# EAGLE design ThrusterBoardV1.1 (EAGLE 6.6.0)
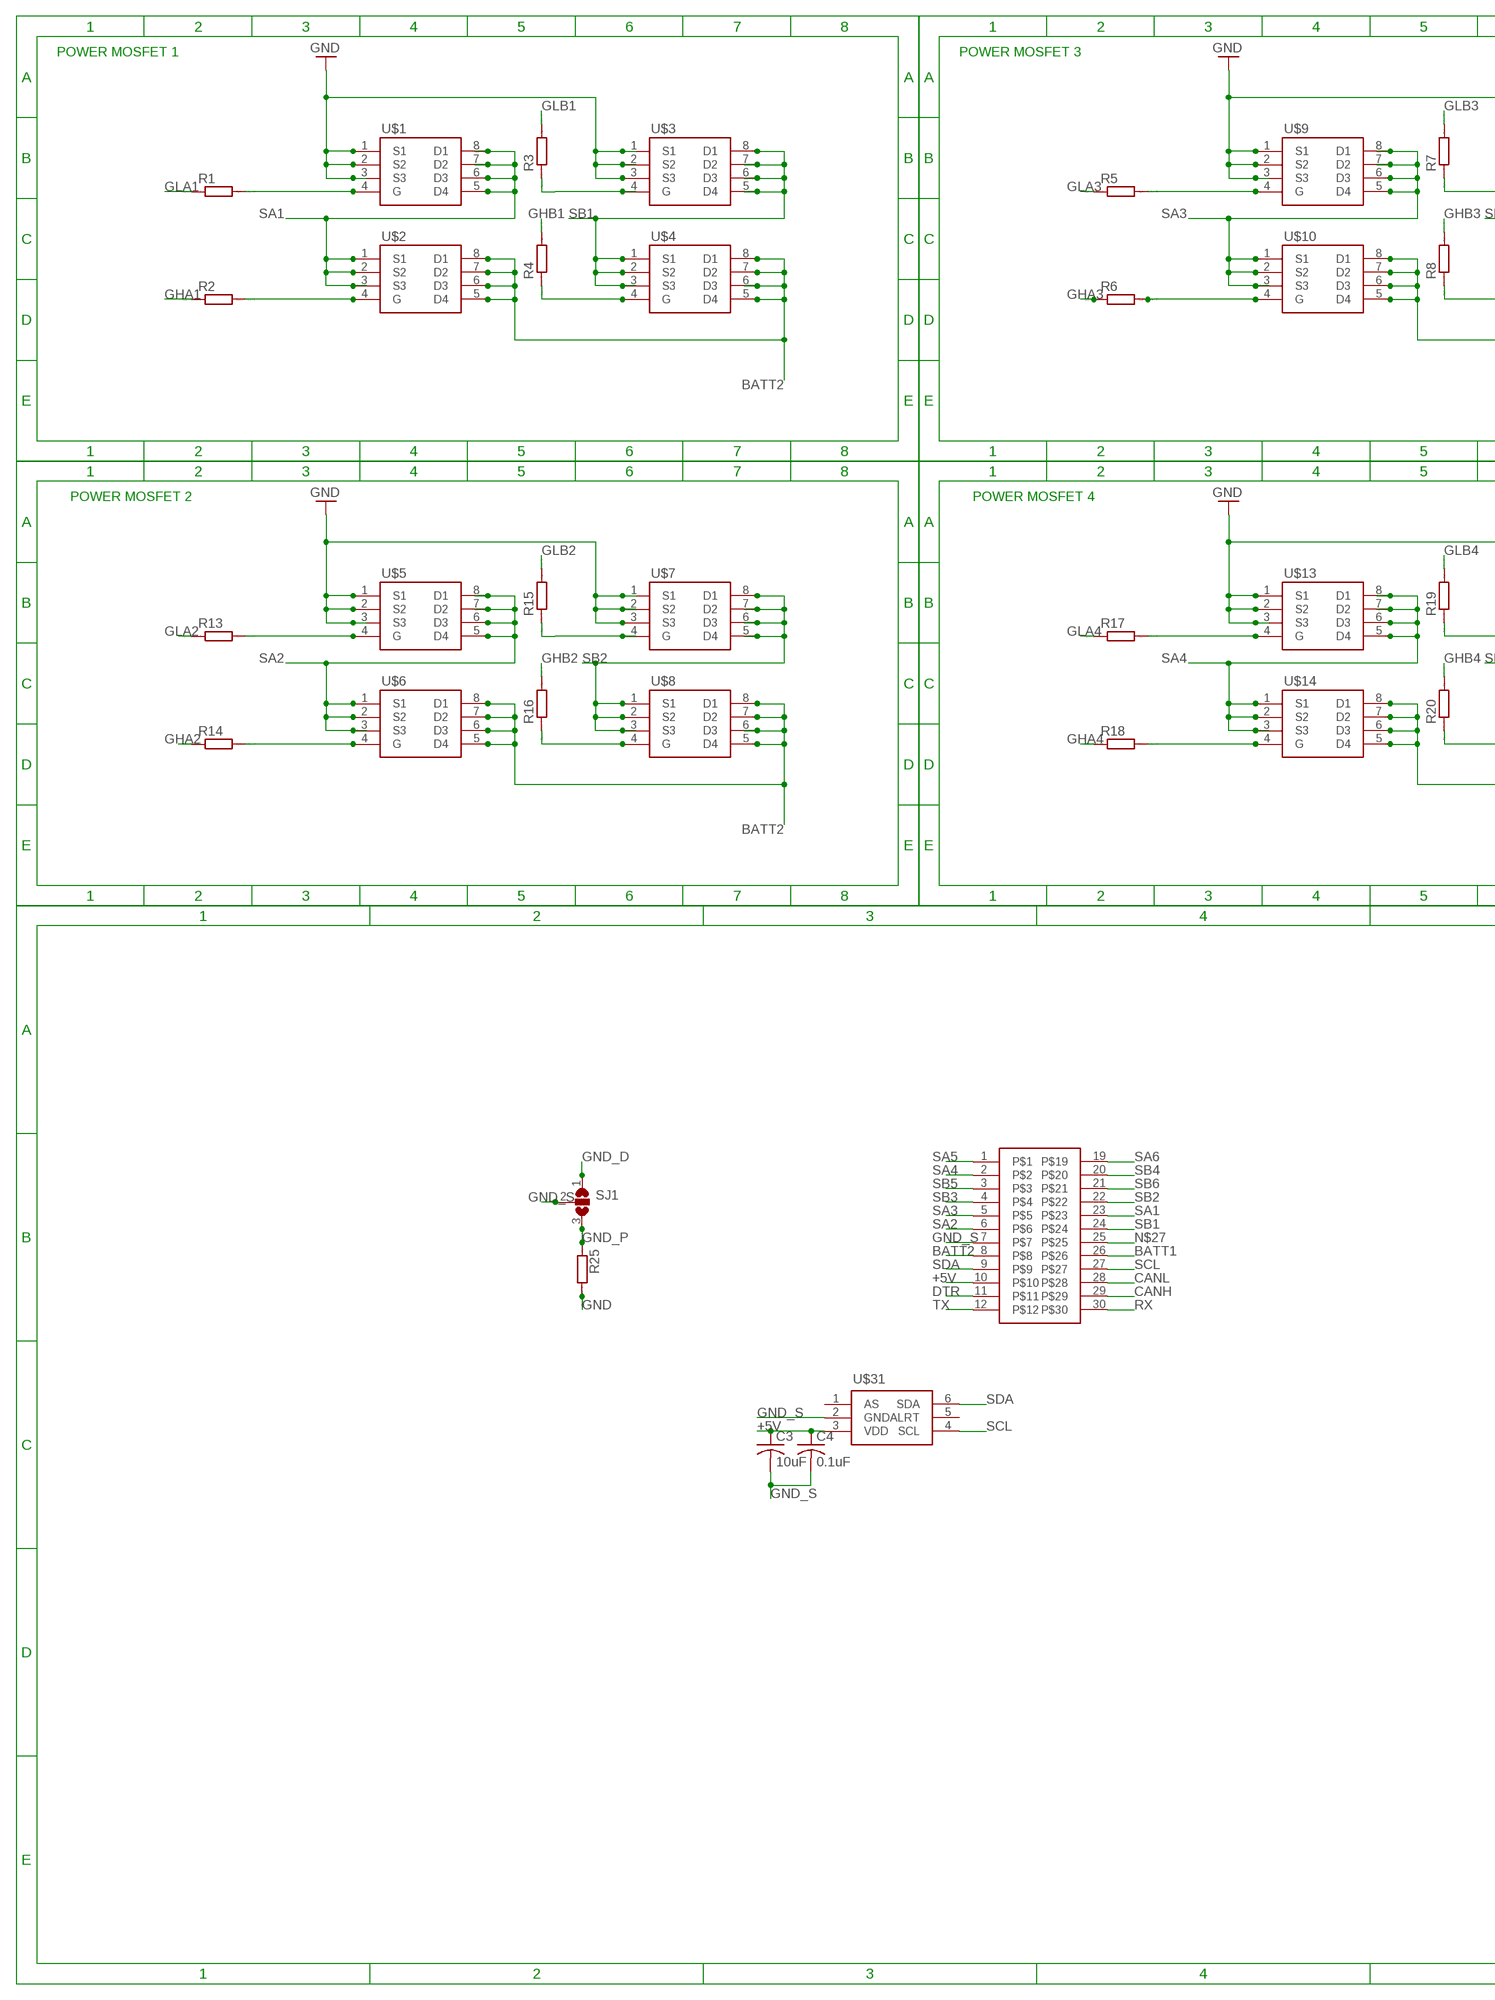
[diagram p0: schematic, sheet 1, part 1 of 2]
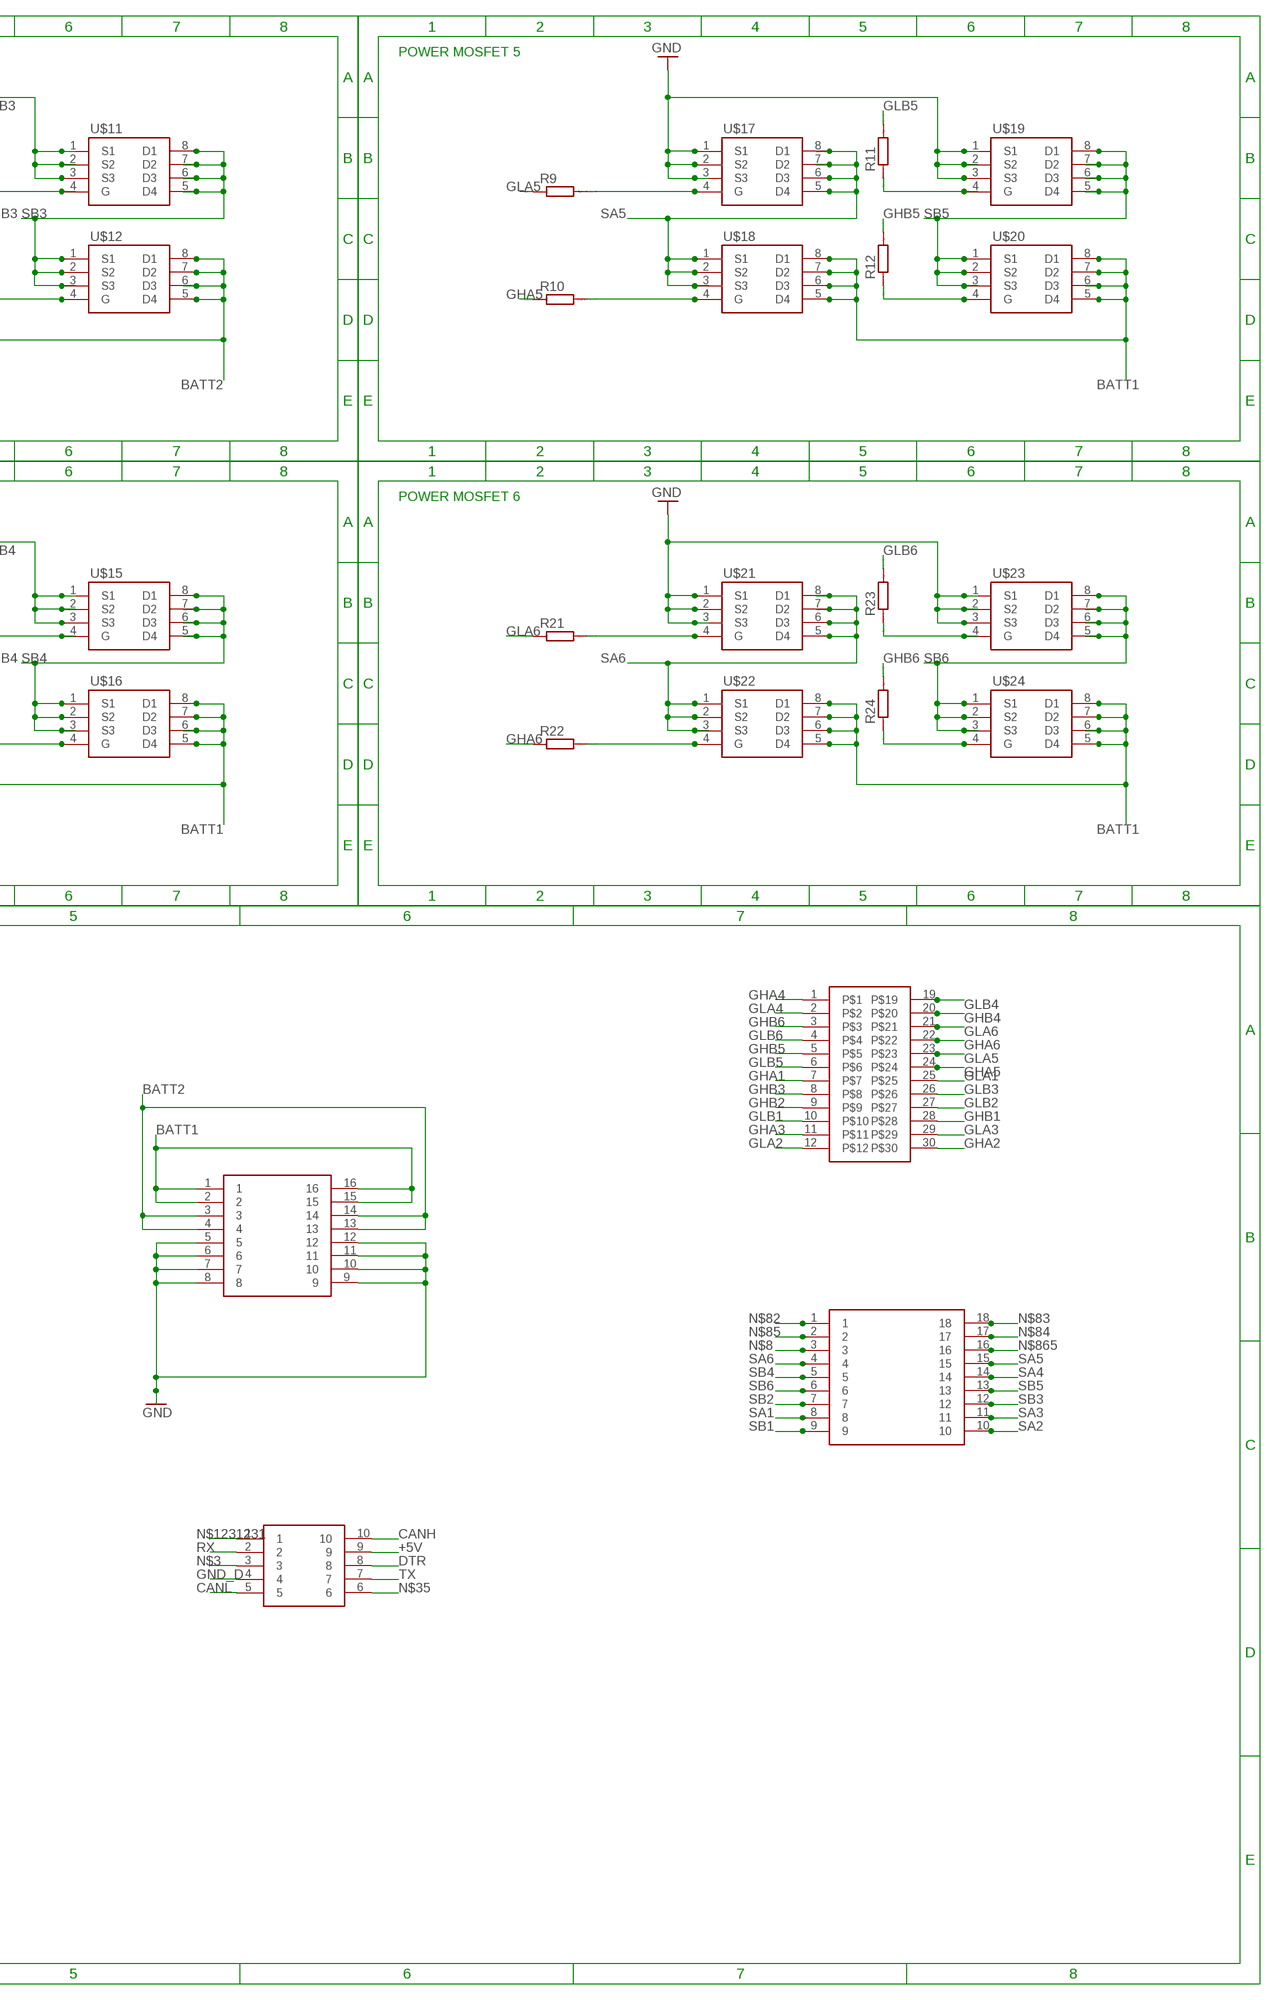
[diagram p1: schematic, sheet 1, part 2 of 2]

## Parts
C3  10uF  C-USC0805  [C0805]
C4  0.1uF  C-USC0805  [C0805]
R1  R  [R0805]
R2  R  [R0805]
R3  R  [R0805]
R4  R  [R0805]
R5  R  [R0805]
R6  R  [R0805]
R7  R  [R0805]
R8  R  [R0805]
R9  R  [R0805]
R10  R  [R0805]
R11  R  [R0805]
R12  R  [R0805]
R13  R  [R0805]
R14  R  [R0805]
R15  R  [R0805]
R16  R  [R0805]
R17  R  [R0805]
R18  R  [R0805]
R19  R  [R0805]
R20  R  [R0805]
R21  R  [R0805]
R22  R  [R0805]
R23  R  [R0805]
R24  R  [R0805]
R25  R  [R0805]
SJ1  SJ2W  [SJ_2]
U$1  IRF7842PBF  [SO-8]
U$2  IRF7842PBF  [SO-8]
U$3  IRF7842PBF  [SO-8]
U$4  IRF7842PBF  [SO-8]
U$5  IRF7842PBF  [SO-8]
U$6  IRF7842PBF  [SO-8]
U$7  IRF7842PBF  [SO-8]
U$8  IRF7842PBF  [SO-8]
U$9  IRF7842PBF  [SO-8]
U$10  IRF7842PBF  [SO-8]
U$11  IRF7842PBF  [SO-8]
U$12  IRF7842PBF  [SO-8]
U$13  IRF7842PBF  [SO-8]
U$14  IRF7842PBF  [SO-8]
U$15  IRF7842PBF  [SO-8]
U$16  IRF7842PBF  [SO-8]
U$17  IRF7842PBF  [SO-8]
U$18  IRF7842PBF  [SO-8]
U$19  IRF7842PBF  [SO-8]
U$20  IRF7842PBF  [SO-8]
U$21  IRF7842PBF  [SO-8]
U$22  IRF7842PBF  [SO-8]
U$23  IRF7842PBF  [SO-8]
U$24  IRF7842PBF  [SO-8]
U$25  15-24-6163  [15-24-6163]
U$26  50-36-1836  [50-36-1836]
U$27  15-24-6103  [15-24-6103]
U$28  15-45-3136  [15-45-3136]
U$29  15-45-3136  [15-45-3136]
U$31  AD7414  [SOT23-6]

## Nets
+5V: C3.1 C4.1 U$27.9 U$29.10 U$31.3(VDD)
ASDASD: R2.2 U$2.4(G)
BATT1: U$14.5(D4) U$14.6(D3) U$14.7(D2) U$14.8(D1) U$16.5(D4) U$16.6(D3) U$16.7(D2) U$16.8(D1) U$18.5(D4) U$18.6(D3) U$18.7(D2) U$18.8(D1) U$20.5(D4) U$20.6(D3) U$20.7(D2) U$20.8(D1) U$22.5(D4) U$22.6(D3) U$22.7(D2) U$22.8(D1) U$24.5(D4) U$24.6(D3) U$24.7(D2) U$24.8(D1) U$25.1 U$25.2 U$25.15 U$25.16 U$29.26
BATT2: U$2.5(D4) U$2.6(D3) U$2.7(D2) U$2.8(D1) U$4.5(D4) U$4.6(D3) U$4.7(D2) U$4.8(D1) U$6.5(D4) U$6.6(D3) U$6.7(D2) U$6.8(D1) U$8.5(D4) U$8.6(D3) U$8.7(D2) U$8.8(D1) U$10.5(D4) U$10.6(D3) U$10.7(D2) U$10.8(D1) U$12.5(D4) U$12.6(D3) U$12.7(D2) U$12.8(D1) U$25.3 U$25.4 U$25.13 U$25.14 U$29.8
CANH: U$27.10 U$29.29
CANL: U$27.5 U$29.28
DTR: U$27.8 U$29.11
GHA1: R2.1 U$28.7
GHA2: R14.1 U$28.30
GHA3: R6.1 U$28.11
GHA4: R18.1 U$28.1
GHA5: R10.1 U$28.24
GHA6: R22.1 U$28.22
GHB1: R4.2 U$28.28
GHB2: R16.2 U$28.9
GHB3: R8.2 U$28.8
GHB4: R20.2 U$28.20
GHB5: R12.2 U$28.5
GHB6: R24.2 U$28.3
GLA1: R1.1 U$28.25
GLA2: R13.1 U$28.12
GLA3: R5.1 U$28.29
GLA4: R17.1 U$28.2
GLA5: R9.1 U$28.23
GLA6: R21.1 U$28.21
GLB1: R3.2 U$28.10
GLB2: R15.2 U$28.27
GLB3: R7.2 U$28.26
GLB4: R19.2 U$28.19
GLB5: R11.2 U$28.6
GLB6: R23.2 U$28.4
GND: R25.2 U$1.1(S1) U$1.2(S2) U$1.3(S3) U$3.1(S1) U$3.2(S2) U$3.3(S3) U$5.1(S1) U$5.2(S2) U$5.3(S3) U$7.1(S1) U$7.2(S2) U$7.3(S3) U$9.1(S1) U$9.2(S2) U$9.3(S3) U$11.1(S1) U$11.2(S2) U$11.3(S3) U$13.1(S1) U$13.2(S2) U$13.3(S3) U$15.1(S1) U$15.2(S2) U$15.3(S3) U$17.1(S1) U$17.2(S2) U$17.3(S3) U$19.1(S1) U$19.2(S2) U$19.3(S3) U$21.1(S1) U$21.2(S2) U$21.3(S3) U$23.1(S1) U$23.2(S2) U$23.3(S3) U$25.5 U$25.6 U$25.7 U$25.8 U$25.9 U$25.10 U$25.11 U$25.12
GND_D: SJ1.1 U$27.4
GND_P: R25.1 SJ1.3
GND_S: C3.2 C4.2 SJ1.2 U$29.7 U$31.2(GND)
N$3: U$27.3
N$5: R3.1 U$3.4(G)
N$8: U$26.3
N$18: R4.1 U$4.4(G)
N$19: R5.2 U$9.4(G)
N$20: R6.2 U$10.4(G)
N$27: U$29.25
N$30: R7.1 U$11.4(G)
N$31: R8.1 U$12.4(G)
N$32: R9.2 U$17.4(G)
N$33: R10.2 U$18.4(G)
N$34: R11.1 U$19.4(G)
N$35: U$27.6
N$36: R12.1 U$20.4(G)
N$37: R13.2 U$5.4(G)
N$38: R14.2 U$6.4(G)
N$39: R16.1 U$8.4(G)
N$40: R15.1 U$7.4(G)
N$41: R17.2 U$13.4(G)
N$42: R18.2 U$14.4(G)
N$43: R20.1 U$16.4(G)
N$44: R19.1 U$15.4(G)
N$45: R21.2 U$21.4(G)
N$46: R22.2 U$22.4(G)
N$47: R23.1 U$23.4(G)
N$48: R24.1 U$24.4(G)
N$82: U$26.1
N$83: U$26.18
N$84: U$26.17
N$85: U$26.2
N$865: U$26.16
N$23131: R1.2 U$1.4(G)
N$1231231: U$27.1
RX: U$27.2 U$29.30
SA1: U$1.5(D4) U$1.6(D3) U$1.7(D2) U$1.8(D1) U$2.1(S1) U$2.2(S2) U$2.3(S3) U$26.8 U$29.23
SA2: U$5.5(D4) U$5.6(D3) U$5.7(D2) U$5.8(D1) U$6.1(S1) U$6.2(S2) U$6.3(S3) U$26.10 U$29.6
SA3: U$9.5(D4) U$9.6(D3) U$9.7(D2) U$9.8(D1) U$10.1(S1) U$10.2(S2) U$10.3(S3) U$26.11 U$29.5
SA4: U$13.5(D4) U$13.6(D3) U$13.7(D2) U$13.8(D1) U$14.1(S1) U$14.2(S2) U$14.3(S3) U$26.14 U$29.2
SA5: U$17.5(D4) U$17.6(D3) U$17.7(D2) U$17.8(D1) U$18.1(S1) U$18.2(S2) U$18.3(S3) U$26.15 U$29.1
SA6: U$21.5(D4) U$21.6(D3) U$21.7(D2) U$21.8(D1) U$22.1(S1) U$22.2(S2) U$22.3(S3) U$26.4 U$29.19
SB1: U$3.5(D4) U$3.6(D3) U$3.7(D2) U$3.8(D1) U$4.1(S1) U$4.2(S2) U$4.3(S3) U$26.9 U$29.24
SB2: U$7.5(D4) U$7.6(D3) U$7.7(D2) U$7.8(D1) U$8.1(S1) U$8.2(S2) U$8.3(S3) U$26.7 U$29.22
SB3: U$11.5(D4) U$11.6(D3) U$11.7(D2) U$11.8(D1) U$12.1(S1) U$12.2(S2) U$12.3(S3) U$26.12 U$29.4
SB4: U$15.5(D4) U$15.6(D3) U$15.7(D2) U$15.8(D1) U$16.1(S1) U$16.2(S2) U$16.3(S3) U$26.5 U$29.20
SB5: U$19.5(D4) U$19.6(D3) U$19.7(D2) U$19.8(D1) U$20.1(S1) U$20.2(S2) U$20.3(S3) U$26.13 U$29.3
SB6: U$23.5(D4) U$23.6(D3) U$23.7(D2) U$23.8(D1) U$24.1(S1) U$24.2(S2) U$24.3(S3) U$26.6 U$29.21
SCL: U$29.27 U$31.4(SCL)
SDA: U$29.9 U$31.6(SDA)
TX: U$27.7 U$29.12
Unconnected: U$31.1(AS) U$31.5(ALRT)

## Notes on the sheet
- POWER MOSFET 1 | POWER MOSFET 3 | POWER MOSFET 5
- POWER MOSFET 2 | POWER MOSFET 4 | POWER MOSFET 6

## Library data of the parts
C3 C4 = rcl:C-US: CAPACITOR, American symbol
R1-R25 = eagle-ltspice:R: RESISTOR, European symbol; SPICEMODEL: NONE; SPICEPREFIX: R
SJ1 = jumper:SJ2W: SMD solder JUMPER
U$1-U$24 = bbauv:IRF7842PBF
U$25 = bbauv:15-24-6163: Mini-Fit® BMI Header, Dual Row, Right Angle, with Snap-in Plastic Peg PCB Lock, 16 Circuits, PA Polyamide Nylon 6/6 94V-0, with Select Gold (Au) Plating
U$26 = bbauv:50-36-1836: Mini-Fit® Jr. Header, Dual Row, Right Angle, with Snap-in Plastic Peg PCB Lock, 18 Circuits, PA Polyamide Nylon 6/6 94V-0,0.76µm Gold (Au) Plating
U$27 = bbauv:15-24-6103
U$28 U$29 = bbauv:15-45-3136: 2.54mm Pitch C-Grid® PCB Connector, Surface Mount, High Profile, Dual Row, Vertical, 36 Circuits
U$31 = bbauv:AD7414: ±0.5°C Accurate, 10-Bit Digital Temperature Sensors in SOT-23 The AD7414/AD7415 are complete temperature monitoring systems in 6-lead and 5-lead SOT-23 packages. They contain a band gap temperature sensor and a 10-bit ADC to monitor and digitize the temperature reading to a resolution of 0.25°C.

## Board
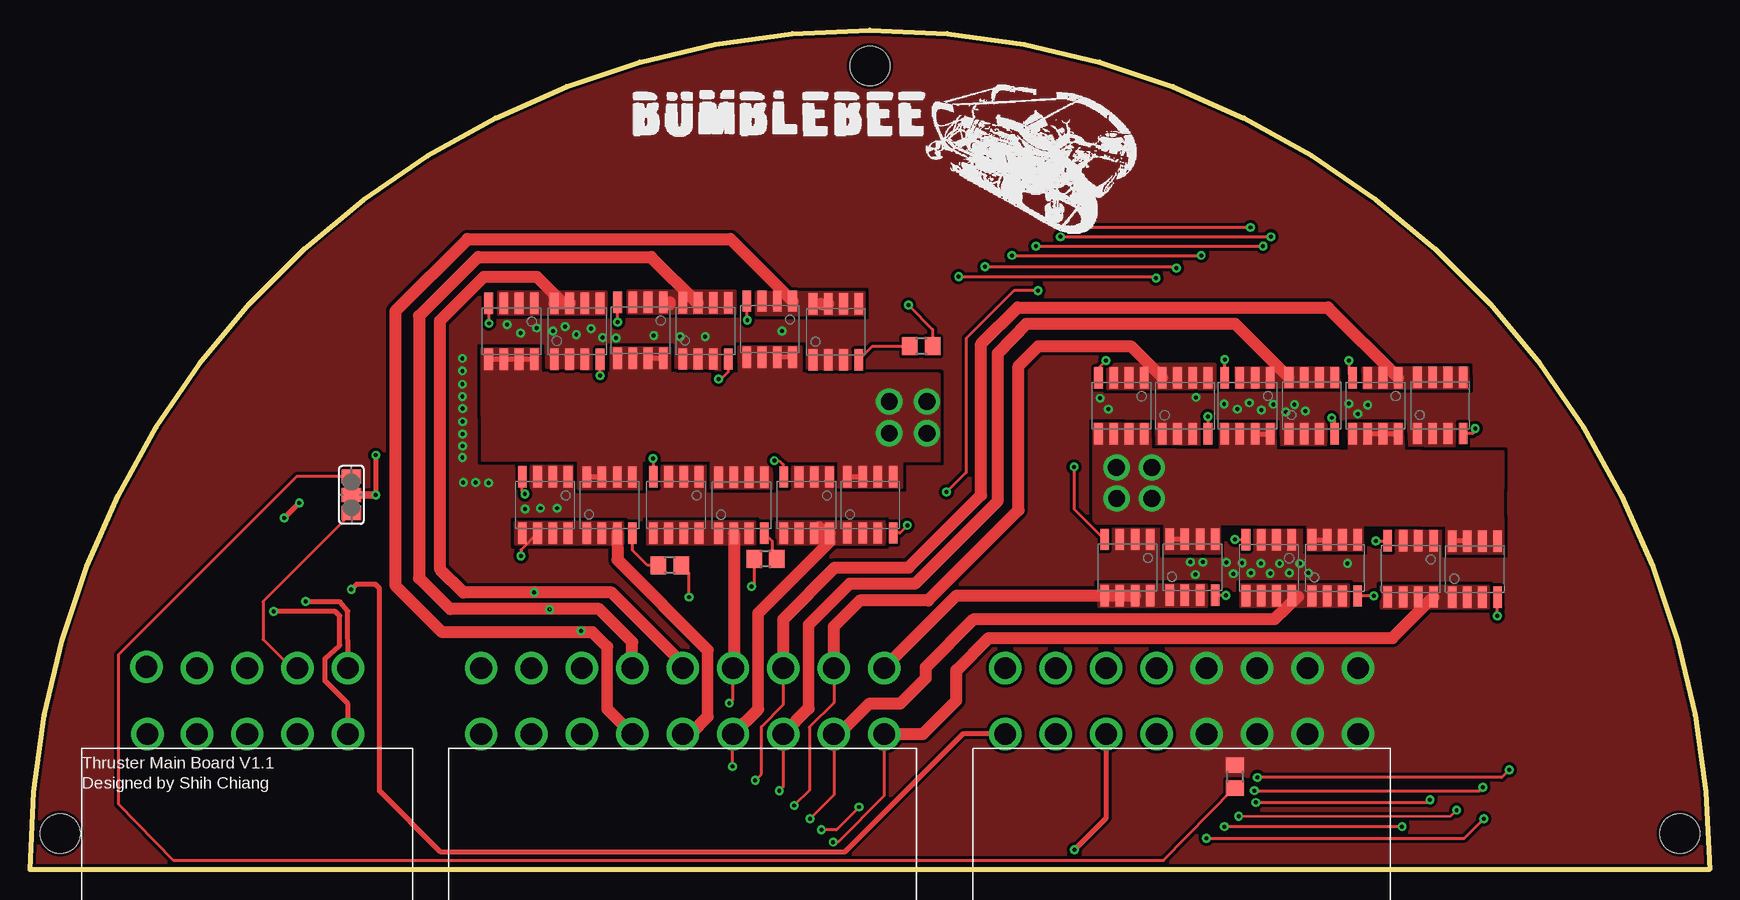
[diagram p2: board, top side]
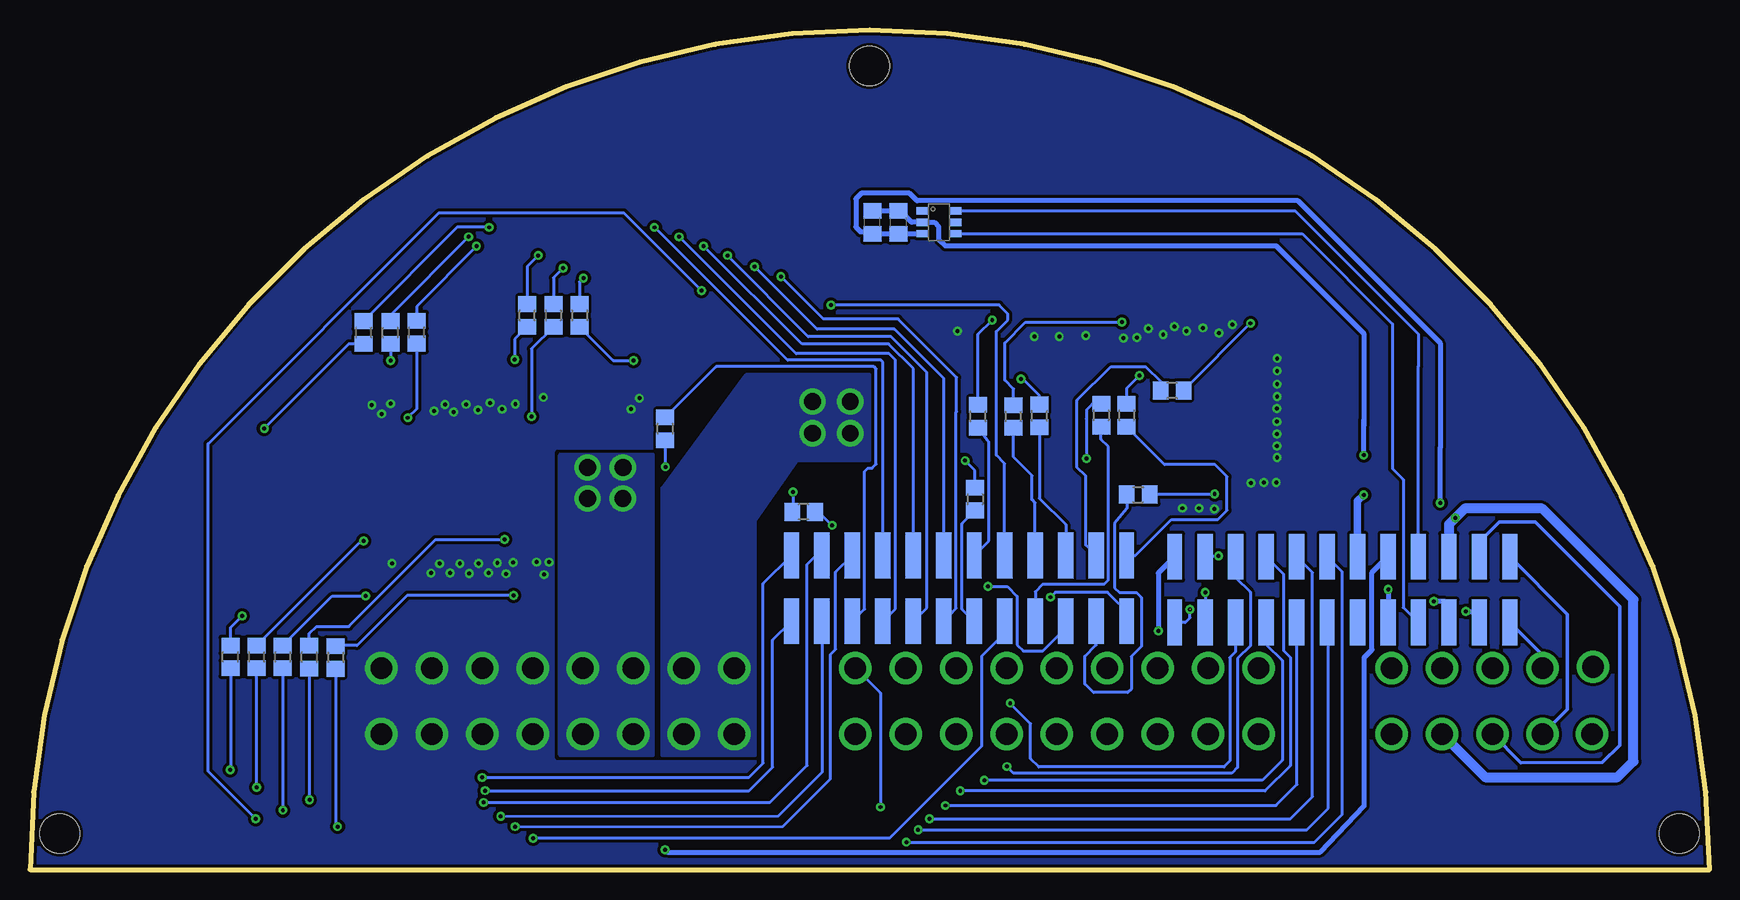
[diagram p3: board, bottom side, seen from below]

Size 140 x 70 mm. Coordinates in mm from the lower left corner, seen from the top.
Outline: 140,0 0,0 arc-90 70,70 arc-90 140,0
Copper layers (1*16): Top 0.035mm / dielectric 1.5mm / Bottom 0.035mm
Design rules "3ozKentronics": minimum track width 10mil, minimum drill 12mil, track to track 10mil, track to pad 10mil, pad to pad 10mil, via to via 10mil, smd to smd 0mil, copper to edge 10mil, drill to drill 10mil, minimum pad ring 12mil, minimum via ring 8mil, stop-mask expansion 2mil, vias tented up to drill 25mil, thermal gap 10mil
Holes 3.3 mm at 2.52,3 137.52,3 70.02,67

### Footprints (pad centres in the part's own frame; a part is rotated, then mirrored left to right if it is on the bottom)
C0805 = smd 1.3 x 1.5: 1 -0.95,0; 2 0.95,0
R0805 = smd 1.3 x 1.5: 1 -0.95,0; 2 0.95,0
SJ_2 = smd 1.168 x 1.6: 1 -1.524,0; 2 0,0; 3 1.524,0
SO-8 = smd 0.72 x 1.78: 1 -1.905,-2.34; 2 -0.635,-2.34; 3 0.635,-2.34; 4 1.905,-2.34; 5 1.905,2.34; 6 0.635,2.34; 7 -0.635,2.34; 8 -1.905,2.34
15-24-6163 = drill 1.8: 1 -14.7,0; 2 -10.5,0; 3 -6.3,0; 4 -2.1,0; 5 2.1,0; 6 6.3,0; 7 10.5,0; 8 14.7,0; 9 14.7,-5.5; 10 10.5,-5.5; 11 6.3,-5.5; 12 2.1,-5.5; 13 -2.1,-5.5; 14 -6.3,-5.5; 15 -10.5,-5.5; 16 -14.7,-5.5
50-36-1836 = drill 1.8 pad 2.184: 1 -16.8,0; 2 -12.6,0; 3 -8.4,0; 4 -4.2,0; 5 0,0; 6 4.2,0; 7 8.4,0; 8 12.6,0; 9 16.8,0; 10 16.8,-5.5; 11 12.6,-5.5; 12 8.4,-5.5; 13 4.2,-5.5; 14 0,-5.5; 15 -4.2,-5.5; 16 -8.4,-5.5; 17 -12.6,-5.5; 18 -16.8,-5.5
15-24-6103 = drill 1.8: 1 -8.4,0.1; 2 -4.2,0; 3 0,0; 4 4.2,0; 5 8.4,0; 6 -8.3,-5.5; 7 -4.2,-5.5; 8 0,-5.5; 9 4.2,-5.5; 10 8.4,-5.5
15-45-3136 = smd 1.219 x 3.81: 1 -22.86,2.745; 19 -22.86,-2.745; 24 -10.16,-2.745 | smd 1.27 x 3.81: 2 -20.32,2.745; 3 -17.78,2.745; 4 -15.24,2.745; 5 -12.7,2.745; 6 -10.16,2.745; 7 -7.62,2.745; 8 -5.08,2.745; 9 -2.54,2.745; 10 0,2.745; 11 2.54,2.745; 12 5.08,2.745; 20 -20.32,-2.745; 21 -17.78,-2.745; 22 -15.24,-2.745; 23 -12.7,-2.745; 25 -7.62,-2.745; 26 -5.08,-2.745; 27 -2.54,-2.745; 28 0,-2.745; 29 2.54,-2.745; 30 5.08,-2.745
SOT23-6 = smd 0.6 x 1.05: 1 -0.95,-1.35; 2 0,-1.35; 3 0.95,-1.35; 4 0.95,1.35; 5 0,1.35; 6 -0.95,1.35

### Placement (x,y rotation side)
C3  67.61,53.96 90 bottom
C4  69.79,53.96 90 bottom
R1  96.37,46.2 270 bottom
R2  94.19,46.2 270 bottom
R3  87.05,36.75 90 bottom
R4  114.53,17.68 270 bottom
R5  116.71,17.71 90 bottom
R6  118.92,17.73 90 bottom
R7  107.77,44.81 90 bottom
R8  98.55,46.2 90 bottom
R9  74.29,43.63 180 top
R10  60.98,37.8 90 bottom
R11  61.22,30.89 270 bottom
R12  75.51,29.82 180 bottom
R13  121.11,17.73 90 bottom
R14  123.29,17.73 90 bottom
R15  112.19,44.78 90 bottom
R16  109.96,44.78 90 bottom
R17  47.62,31.25 0 bottom
R18  53.34,25.37 180 top
R19  48.59,37.87 270 bottom
R20  44.8,39.94 180 bottom
R21  55.86,37.82 90 bottom
R22  58.02,37.77 90 bottom
R23  50.7,37.87 270 bottom
R24  61.31,25.9 180 top
R25  100.46,7.75 90 top
SJ1  26.8,31.24 90 top
U$1  96.28,38.67 0 top
U$2  90.97,38.66 180 top
U$3  91.48,25.18 180 top
U$4  96.9,25.21 0 top
U$5  115.08,25.07 180 top
U$6  120.43,25.05 0 top
U$7  117.55,38.69 0 top
U$8  112.14,38.67 180 top
U$9  103.26,25.16 180 top
U$10  108.76,25.15 0 top
U$11  106.84,38.69 0 top
U$12  101.48,38.67 180 top
U$13  42.94,30.4 180 top
U$14  48.31,30.39 0 top
U$15  45.62,44.88 0 top
U$16  40.13,44.88 180 top
U$17  67.17,44.83 0 top
U$18  61.66,45.05 180 top
U$19  64.74,30.39 180 top
U$20  70.04,30.4 0 top
U$21  56.32,44.9 0 top
U$22  50.89,44.96 180 top
U$23  53.86,30.4 180 top
U$24  59.3,30.38 0 top
U$25  96,16.8 0 top
U$26  54.4,16.8 0 top
U$27  18.1,16.8 0 top
U$28  71.45,23.44 180 bottom
U$29  21.72,23.34 0 bottom
U$31  64.23,53.96 270 bottom

### Tracks (layer width: path | path; a pad name or v marks a point on that pad's centre or on a via)
+5V  (via drill 0.33)
  Top 0.406: v22.45,30.56 v21.2,29.3
  Bottom 0.406: U$31.3 C3.1 C4.1 69.96,53.19 70.78,53.19 71.16,53.57 71.16,55.93 70.71,56.39 66.69,56.39 66.06,55.75 34.31,55.75 22.45,43.89 22.45,35.17 22.45,35.16 v22.45,30.56
  Bottom 0.813: U$27.9 18.7,7.7 7.67,7.7 6.35,9.02 6.35,22.5 13.94,30.1 20.4,30.1 v21.2,29.3 21.72,28.78 U$29.10 | 21.84,25.37 21.72,25.5 U$29.10 | U$29.10
ASDASD  (via drill 0.33)
  Top 0.254: v89.68,42.44 89.07,41.83 U$2.4
  Top 0.305: 89.06,40.99 U$2.4
  Bottom 0.254: R2.2 91.39,42.44 v89.68,42.44
BATT1  (via drill 0.33, 1.4 pad 2.18)
  Top 0.406: U$22.8 U$22.7 | U$20.7 U$20.8 | U$18.8 U$18.7 | U$16.8 U$16.5 | U$14.7 U$14.8 | U$25.16 77.77,11.3 67.91,1.45 34.23,1.45 29.13,6.55 29.13,23.44 28.8,23.77 27.22,23.77 v26.79,23.34
  Bottom 0.406: v26.79,23.34 U$29.26
  other vias: 71.63,39.01 74.78,39.01 71.63,36.37 74.78,36.37
  pour Top: 37.77,34.21 75.74,34.14 75.74,41.22 37.74,41.3
  pour Top (no thermals): 37.7,43.43 42.47,43.41 42.55,41.02 37.67,41.02
  pour Top (no thermals): 48.44,43.51 53.32,43.48 53.32,40.64 48.44,40.64
  pour Top (no thermals): 59.11,43.56 64.27,43.56 64.29,40.77 59.13,40.77
  pour Top (no thermals): 56.8,34.62 61.78,34.57 61.8,31.78 56.82,31.83
  pour Top (no thermals): 45.72,34.57 50.93,34.54 50.96,31.75 45.75,31.78
  pour Bottom (isolate 0.254, no thermals): 87.25,9.55 87.25,31.78 80.26,41.22 70.03,41.22 70.03,34.16 76.12,34.14 79.63,29.08 79.63,9.55
  pour Top (no thermals): 67.44,34.67 72.65,34.65 72.65,31.85 67.44,31.88
BATT2  (via drill 0.33, 1.4 pad 2.18)
  Top 0.406: U$12.7 U$12.8 | U$10.8 U$10.7 | U$4.8 U$4.7 | U$8.8 U$8.7 U$8.6 | U$6.7 U$6.8 | U$25.14 89.7,4.29 v87.06,1.65
  Bottom 0.406: U$29.8 28.14,24.75 28.14,18.31 28.77,17.68 28.77,5.31 32.45,1.45 86.86,1.45 v87.06,1.65
  other vias: 90.57,33.53 90.58,30.94 93.52,30.94 93.52,33.53
  pour Bottom (isolate 0.254, no thermals): 88.14,9.55 95.76,9.55 95.76,34.57 88.14,34.57
  pour Top (no thermals): 88.7,35 122.77,34.82 122.75,28.7 88.7,28.88
  pour Top (no thermals): 99.22,37.13 103.79,37.11 103.81,34.57 99.22,34.57
  pour Top (no thermals): 109.93,37.13 114.35,37.16 114.51,34.54 109.96,34.57
  pour Top (no thermals): 94.62,29.29 99.17,29.31 99.17,26.39 94.62,26.37
  pour Top (no thermals): 106.51,29.57 111.08,29.54 111.08,26.62 106.51,26.64
  pour Top (no thermals): 118.11,29.34 122.76,29.29 122.76,26.37 118.11,26.42
  pour Top (no thermals): 88.7,37.19 93.35,37.08 93.4,34.8 88.7,34.85
CANH  (via drill 0.33)
  Top 0.406: U$27.10 26.5,13.81 24.59,15.72 24.59,17.6 25.83,18.69 25.83,21.16 25.45,21.51 v20.32,21.51
  Bottom 0.406: U$29.29 19.15,20.63 19.15,21.49 19.2,21.54 19.23,21.51 v20.32,21.51
CANL  (via drill 0.33)
  Top 0.406: U$27.5 26.49,21.56 25.86,22.3 25.81,22.35 v22.99,22.35
  Bottom 0.406: U$29.28 21.69,20.63 21.69,22.02 22.02,22.35 v22.99,22.35
DTR
  Bottom 0.305: U$27.8 15.72,8.92 8.94,8.94 7.47,10.36 7.47,21.92 14.5,28.98 17.5,28.98 19.18,27.3 U$29.11
GHA1  (via drill 0.33)
  Top 0.254: v77.41,49.43 93.74,49.43 v93.87,49.3
  Bottom 0.254: v77.41,49.43 77.39,49.43 73.86,45.9 67.63,45.9 62.77,41.03 62.77,38.16 62.81,38.15 62.81,21.77 U$28.7 | v93.87,49.3 94.19,48.98 R2.1
GHA2  (via drill 0.33)
  Top 0.254: v123.31,8.31 122.68,7.67 v102.3,7.67
  Bottom 0.254: R14.1 123.29,8.32 v123.31,8.31 | v102.3,7.67 80.08,7.67 78.89,8.86 78.89,23.83 U$28.30
GHA3  (via drill 0.33)
  Top 0.254: v100.75,4.44 118.43,4.47 v118.92,4.95
  Bottom 0.254: R6.1 v118.92,4.96 v118.92,4.95 | U$28.11 73.96,20.67 73.96,8.13 77.62,4.47 v100.75,4.44
GHA4  (via drill 0.33)
  Top 0.254: 54.29,24.73 R18.1 54.91,24.75 54.91,22.73 v54.92,22.71 | v54.92,22.71 54.92,22.84 v54.92,22.71
  Bottom 0.254: U$28.1 48.59,22.16 49.23,22.16 50.18,23.11 54.52,23.11 v54.92,22.71
GHA5
  Bottom 0.254: U$28.24 60.06,27.42 60.06,35.66 60.23,35.82 R10.1
GHA6
  Bottom 0.254: R22.1 58.03,36.81 58.03,34.42 56.44,32.83 56.48,32.79 56.48,30.84 56.21,30.56 U$28.22
GHB1  (via drill 0.33)
  Top 0.254: v114.37,3.58 v99.56,3.58
  Bottom 0.254: R4.2 114.53,3.74 v114.37,3.58 | v99.56,3.58 77.21,3.61 73.27,7.54 73.27,17.93 72.84,18.36 72.84,24.8 U$28.28
GHB2  (via drill 0.33)
  Top 0.254: v85.9,52.76 v103.45,52.76
  Bottom 0.254: U$28.9 67.86,21.75 67.86,42.47 68.4,43 76.14,43 v85.9,52.76 | v103.45,52.76 109.96,46.25 R16.2
GHB3  (via drill 0.33)
  Top 0.254: v81.86,51.21 v97.63,51.21
  Bottom 0.254: U$28.8 65.25,21.82 65.25,41.45 68.22,44.42 75.13,44.42 v81.86,51.21 | v97.63,51.21 98.55,50.28 R8.2
GHB4
  Bottom 0.254: U$28.20 51.99,27.05 51.99,32.82 52.72,33.5 52.72,39.14 49.88,41.93 47.01,41.93 45.75,40.67 R20.2
GHB5  (via drill 0.33)
  Top 0.254: v98.06,2.62 119.58,2.62 v121.2,4.24 | v84.02,48.26 82.01,48.26 78.02,44.27 78.02,33.1 v76.4,31.47
  Bottom 0.254: U$28.5 58.75,19.7 60.67,17.78 60.67,10.29 68.34,2.62 v98.06,2.62 | v84.02,48.26 90.52,54.76 105.89,54.76 125.16,35.48 125.16,8.2 v121.2,4.24 | v76.4,31.47 76.4,29.89 R12.2
GHB6  (via drill 0.33)
  Top 0.254: R24.2 60.36,23.82 v60.14,23.6
  Bottom 0.254: v60.14,23.6 58.54,23.6 57.73,22.78 57.73,18.74 57.19,18.21 55.57,18.21 54.1,19.68 54.1,20.27 U$28.3
GLA1  (via drill 0.33)
  Top 0.254: v79.6,50.27 95.45,50.27 v95.57,50.14
  Bottom 0.254: U$28.25 63.83,40.95 67.94,45.06 74.39,45.06 v79.6,50.27 | v95.57,50.14 96.37,49.34 R1.1
GLA2  (via drill 0.33)
  Top 0.254: v102.08,6.58 120.84,6.58 v121.11,6.85
  Bottom 0.254: v102.08,6.58 80.05,6.58 78.1,8.53 78.1,19.13 U$28.12 | v121.11,6.85 R13.1 | R13.1
GLA3  (via drill 0.33)
  Top 0.254: v102.18,5.59 116.5,5.59 v116.71,5.82
  Bottom 0.254: v102.18,5.59 78.33,5.59 75.23,8.69 75.23,25.45 74.49,26.19 U$28.29 | v116.71,5.82 R5.1
GLA4
  Bottom 0.254: R17.1 48.57,30.09 49.6,28.85 49.6,23.49 49.17,23.09 47.77,23.09 47.36,22.68 47.36,18.59 48.2,17.75 48.2,15.06 48.51,14.76 51.35,14.76 52.06,15.47 52.06,17.78 51.13,18.71 U$28.2
GLA5  (via drill 0.33)
  Top 0.254: v73.22,47.07 75.25,45.04 R9.1
  Bottom 0.254: U$28.23 58.75,33.84 59.45,34.54 59.45,44.86 58.49,45.82 58.49,46.33 59.23,47.07 v73.22,47.07
GLA6
  Bottom 0.254: 53.75,26.27 U$28.21 53.66,28.75 55.86,30.95 R21.1
GLB1
  Bottom 0.254: U$28.10 70.43,21.72 70.43,33.2 70.15,33.48 69.79,33.48 69.46,33.81 69.46,41.73 69.67,41.93 82.81,41.93 R3.2
GLB2  (via drill 0.33)
  Top 0.254: v87.95,53.54 v101.72,53.54
  Bottom 0.254: U$28.27 68.91,42.3 69.08,42.47 76.85,42.47 v87.95,53.54 | v101.72,53.54 104.4,53.54 R15.2
GLB3  (via drill 0.33)
  Top 0.254: v83.86,51.99 v102.79,51.97
  Bottom 0.254: U$28.26 66.37,41.76 68.42,43.81 75.63,43.81 v83.86,51.99 | v102.79,51.97 107.77,46.94 R7.2
GLB4
  Bottom 0.254: U$28.19 47.84,26.19 44.85,29.18 40.99,29.18 40.23,29.95 40.23,32.77 41.22,33.76 45.43,33.76 R19.2
GLB5
  Bottom 0.254: U$28.6 62.3,21.71 62.3,28.85 R11.2
GLB6
  Bottom 0.254: U$28.4 56.21,21.84 56.2,21.84 56.2,23.16 55.59,23.77 50.46,23.77 50.11,24.13 50.11,35.25 50.72,35.86 50.72,36.91 R23.2
GND  (via drill 0.33)
  other vias: 99.54,38.81 97.21,39.37 100.63,38.38 101.65,38.91 102.64,38.3 103.63,38.79 104.7,38.15 105.41,38.76 106.3,38.23 109.93,38.84 110.69,38 111.51,38.73 89.2,39.29 89.89,38.38 39.78,45.44 40.89,44.73 42.24,45.16 43.59,44.88 44.6,45.26 45.54,44.6 46.76,45.11 47.73,44.35 48.84,44.32 51.99,44.53 54.2,44.45 56.29,44.45 62.69,44.88 41.27,30.07 42.55,30.12 43.94,30.12 36.07,35.31 36.04,42.62 37.13,32.26 36.12,32.26 38.23,32.23 36.04,34.34 36.04,39.45 36.07,36.32 36.07,37.34 36.07,38.43 36.04,40.46 36.04,41.58 96.72,25.63 97.15,24.59 97.76,25.63 99.72,25.6 100.3,24.66 101.04,25.55 101.78,24.74 102.62,25.53 103.38,24.69 104.17,25.5 104.98,24.74 105.84,25.5 106.58,24.71 109.83,25.53
  pour Top (rank 2, no thermals): 0,0 140,0 140,70 0,70
  pour Bottom (isolate 0.254, rank 2, no thermals): 0,0 140,0 140,70 0,70
GND_D
  Top 0.254: SJ1.1 19.43,22.35 19.43,19.18 21.81,16.8 U$27.4
GND_P
  Top 0.254: SJ1.3 22.23,32.77 7.37,17.91 7.37,5.46 11.94,0.76 94.49,0.76 100.33,6.73 100.4,6.8 | 100.4,6.8 100.46,6.86 | R25.1 100.4,6.8
GND_S  (via drill 0.33)
  Top 0.406: v28.83,31.24 v28.83,34.54 28.78,34.59
  Top 0.61: SJ1.2 v28.83,31.24
  Bottom 0.406: 67.57,54.88 C3.2 | C3.2 C4.2 | v28.83,34.54 28.83,36.98 | 28.83,36.98 28.83,37.45 | C3.2 67.45,54.91 66.5,53.96 U$31.2 64.62,53.96 64.26,53.59 64.26,52.58 63.7,52.02 36.14,52.02 28.82,44.7 28.82,36.99 28.83,36.98
  Bottom 0.61: v28.83,31.24 29.34,30.73 U$29.7
N$5  (via drill 0.33)
  Top 0.254: v87.04,33.58 87.04,30.05 U$3.4
  Bottom 0.254: R3.1 v87.05,33.59 v87.04,33.58
N$18  (via drill 0.33)
  Top 0.254: v99.69,22.86 v99.68,22.87 U$4.4
  Top 0.305: 98.87,22.94 arc90 U$4.4
  Top 0.406: 98.86,22.93 U$4.4
  Bottom 0.254: v99.69,22.86 108.55,22.86 112.74,18.67 114.49,18.67 R4.1
N$19  (via drill 0.33)
  Top 0.254: v100.45,27.51 v100.46,27.5 U$9.4
  Top 0.406: U$9.4
  Bottom 0.254: v100.45,27.51 106.19,27.51 113.43,20.27 116.12,20.27 116.71,19.68 R5.2
N$20  (via drill 0.33)
  Top 0.254: v112.03,22.81 111.7,22.81 U$10.4
  Bottom 0.254: R6.2 114.8,22.81 v112.03,22.81
N$30  (via drill 0.33)
  Top 0.254: 108.79,36.3 U$11.4 108.74,37.43 v108.5,37.67
  Top 0.406: 108.74,36.38 U$11.4
  Bottom 0.254: R7.1 107.77,38.4 v108.5,37.67
N$31  (via drill 0.33)
  Top 0.254: v99.59,42.52 99.57,42.51 U$12.4
  Top 0.406: U$12.4
  Bottom 0.254: R8.1 99.59,44.21 v99.59,42.52
N$32
  Top 0.254: U$17.4 70.23,43.63 R9.2
  Top 0.406: U$17.4
N$33  (via drill 0.33)
  Top 0.254: v59.79,45.82 59.79,47.36 U$18.4
  Top 0.406: 59.75,47.17 U$18.4
  Bottom 0.254: R10.2 60.98,44.64 v59.79,45.82
N$34  (via drill 0.33)
  Top 0.254: v62.05,34.09 62.48,34.06 62.78,33.78 62.81,32.76 U$19.4
  Top 0.406: U$19.4
  Bottom 0.254: R11.1 61.24,33.26 v62.05,34.09
N$36  (via drill 0.33)
  Top 0.254: v73.13,28.7 72.51,28.06 U$20.4
  Top 0.406: U$20.4
  Bottom 0.254: R12.1 74.27,29.82 v73.13,28.7
N$37  (via drill 0.33)
  Top 0.254: v112.18,27.41 v112.19,27.41 U$5.4
  Bottom 0.254: R13.2 112.38,27.41 v112.18,27.41
N$38  (via drill 0.33)
  Top 0.254: v122.32,21.16 122.32,22.69 U$6.4
  Top 0.406: U$6.4
  Bottom 0.254: R14.2 123.29,20.19 v122.32,21.16
N$39  (via drill 0.33)
  Top 0.254: v109.95,42.44 109.95,41.3 U$8.4
  Bottom 0.254: R16.1 109.96,42.45 v109.95,42.44
N$40  (via drill 0.33)
  Top 0.254: v120.47,36.78 120.47,36.58 120.24,36.35 U$7.4
  Bottom 0.254: R15.1 113.42,43.83 v120.47,36.78
N$41  (via drill 0.33)
  Top 0.254: v41.25,31.32 41.04,31.53 U$13.4
  Top 0.406: U$13.4
  Bottom 0.254: R17.2 46.6,31.32 v41.25,31.32
N$42
  Top 0.254: 50.25,28.08 50.25,27.48 50.23,27.47 50.23,26.62 51.49,25.37 R18.2
  Top 0.406: 50.25,28.08 U$14.4
N$43  (via drill 0.33)
  Top 0.254: v38.25,45.54 38.25,47.19 U$16.4
  Top 0.406: 38.21,47.19 U$16.4
  Bottom 0.254: v38.25,45.54 43.62,40.18 43.64,40.18 R20.1
N$44  (via drill 0.33)
  Top 0.254: v47.52,41.17 U$15.4
  Bottom 0.254: v47.52,41.17 48.59,40.1 R19.1
N$45  (via drill 0.33)
  Top 0.254: U$21.4 58.22,41.5 57.61,40.89 v57.4,40.89
  Bottom 0.254: R21.2 55.86,39.53 57.23,40.89 v57.4,40.89
N$46  (via drill 0.33)
  Top 0.254: v48.97,45.64 48.97,47.29 U$22.4
  Bottom 0.254: R22.2 58.02,40.07 58.74,40.79 58.74,43.92 57.02,45.64 v48.97,45.64
N$47  (via drill 0.33)
  Top 0.254: v51.94,34.26 51.96,34.25 U$23.4
  Top 0.305: 51.95,32.73 U$23.4
  Bottom 0.254: v51.94,34.26 51.94,37.58 51.94,37.59 51.94,38.33 51.44,38.82 R23.1
N$48
  Top 0.254: U$24.4 61.87,27.38 61.87,26.54 62.26,26.15 R24.1
N$23131  (via drill 0.33)
  Top 0.254: v98.19,37.77 U$1.4
  Top 0.406: U$1.4
  Bottom 0.254: R1.2 98.19,43.43 v98.19,37.77
RX
  Bottom 0.305: U$27.2 13.9,17.86 U$29.30
SA1  (via drill 0.33)
  Top 0.254: 67,20.26 67,13.91 64.97,11.89 64.97,6.6 v63.7,5.33
  Top 0.406: U$1.5 98.17,41.03
  Top 1.016: U$26.8 67,20.26 69.17,22.43 74.86,22.43 82.4,29.97 82.4,41.99 84.05,43.64 91.75,43.64 U$1.8
  Bottom 0.254: v63.7,5.33 36.14,5.33 34.39,7.09 34.39,20.57 U$29.23
  pour Top (no thermals): 89.84,42.09 98.78,42.09 98.78,40.11 89.84,40.11
SA2  (via drill 0.33)
  Top 0.254: U$26.10 71.2,6.15 67.34,2.29 v66.95,2.29
  Top 1.016: U$26.10 74.42,11.3 77.22,14.1 77.22,16.61 79.91,19.3 113.56,19.3 U$5.8
  Bottom 0.254: v66.95,2.29 32.92,2.29 30.63,4.57 30.63,24.84 U$29.6
  pour Top (no thermals): 112.63,23.62 121.57,23.62 121.57,21.79 112.63,21.79
SA3  (via drill 0.33)
  Top 0.254: U$26.11 67,6.22 v65.02,4.24
  Top 1.016: U$26.11 67.44,11.3 69.98,13.84 72.55,13.84 74.68,15.98 74.68,16.87 78.69,20.88 103.74,20.88 105.69,22.76
  Bottom 0.254: v65.02,4.24 34.93,4.24 33.1,6.07 33.1,24.76 U$29.5
  pour Top (no thermals): 100.94,23.75 109.88,23.75 109.88,21.92 100.94,21.92
SA4  (via drill 0.33)
  Top 0.254: U$13.6 40.92,26.67 v40.92,26.14
  Top 0.965: 56.49,18.29 56.49,12.75
  Top 1.016: U$14.3 48.97,25.83 56.49,18.29 | 56.49,12.75 55.06,11.3 U$26.14
  Bottom 0.254: v40.92,26.14 40.97,26.09 U$29.2
  pour Top (no thermals): 40.47,28.96 49.41,28.96 49.41,27.13 40.47,27.13
SA5  (via drill 0.33)
  Top 0.254: 46.89,19.79 46.79,19.89 v45.95,19.89
  Top 0.965: 48.11,13.39 48.11,18.56
  Top 1.016: U$26.15 48.11,13.39 | 65.92,47.17 U$17.7 | 48.11,18.56 46.89,19.79 34.37,19.79 30.45,23.7 30.45,46.56 36.47,52.58 58.38,52.58 U$18.1
  Bottom 0.406: U$29.1 45.95,24.72 v45.95,19.89
  pour Top (no thermals): 60.58,48.11 69.52,48.11 69.52,46.28 60.58,46.28
SA6  (via drill 0.33)  (1 unrouted)
  Top 0.254: 47.45,21.72 43.31,21.72
  Top 1.016: 53.32,47.28 53.32,47.12 | U$26.4 50.2,18.96 47.45,21.72 35.03,21.72 32.44,24.31 32.44,46.15 37.36,51.08 51.79,51.08 55.63,47.24 U$21.7
  Bottom 0.254: U$29.19 43.69,20.6 43.31,20.98 v43.31,21.69
  pour Top (no thermals): 49.84,48.23 58.78,48.23 58.78,46.41 49.84,46.41
SB1  (via drill 0.33)
  Top 0.254: v69.11,5.21 67.21,3.3 v65.96,3.3
  Top 1.016: U$3.7 77.24,22.84 U$26.9
  Bottom 0.254: U$26.9 69.11,14.71 v69.11,5.21 | v65.96,3.3 33.58,3.3 31.78,5.11 31.78,20.49 U$29.24
  pour Top (no thermals): 89.11,23.75 98.05,23.75 98.05,21.95 89.11,21.95
SB2  (via drill 0.33)
  Top 0.254: v60.45,7.44 60.96,7.95 60.96,11.91 62.8,13.75 U$26.7
  Top 1.016: U$26.7 62.8,20.87 67.1,25.17 73.25,25.17 79.29,31.22 79.29,43.84 82.31,46.86 108.19,46.86 U$8.1
  Bottom 0.254: U$29.22 36.96,18.77 35.61,17.42 35.61,9.12 37.29,7.44 v60.45,7.44
  pour Top (no thermals): 111.1,41.81 119.87,41.81 119.89,40.13 111.2,40.13
SB3  (via drill 0.33)
  Top 0.254: v62.46,6.55 62.8,6.89 U$26.12
  Top 0.965: 64.9,13.43 64.9,20.4
  Top 1.016: U$26.12 64.9,13.43 | 64.9,20.4 68.33,23.83 73.77,23.83 80.67,30.73 80.67,43.05 83.06,45.51 100.45,45.51 U$11.8
  Bottom 0.254: U$29.4 35.51,24.64 35.51,18.26 34.95,17.7 34.95,8.66 37.06,6.55 v62.46,6.55
  pour Top (no thermals): 100.51,41.86 109.07,41.81 109.1,40.23 100.56,40.21
SB4  (via drill 0.33)
  Top 0.254: 36.14,23.09 36.17,23.11 v42.04,23.11
  Top 1.016: 43.94,47.22 44.45,47.22 | 44.45,47.22 U$15.7 | 43.71,47.7 U$15.8 | U$26.5 54.4,17.18 48.49,23.09 36.14,23.09 34.16,25.07 34.16,45.75 37.85,49.43 42.24,49.43 44.45,47.22
  Bottom 0.254: v42.04,23.11 U$29.20
  pour Top (no thermals): 39.07,48.16 48.01,48.16 48.01,46.33 39.07,46.33
SB5  (via drill 0.33)
  Top 0.254: v58.57,8.59 58.57,11.27 U$26.13
  Top 0.965: 60.71,13.36 60.71,21.36
  Top 1.016: U$26.13 60.71,13.36 | 65.79,27.71 65.79,28.52 | 66.12,27.52 U$19.8 66.65,27.33 60.71,21.36
  Bottom 0.254: U$29.3 39.5,24.36 38.28,23.14 38.28,18.64 39.34,17.58 39.34,8.52 39.83,8.03 58.01,8.03 v58.57,8.59
  pour Top (no thermals): 62.28,28.98 71.23,28.98 71.23,27.15 62.28,27.15
SB6  (via drill 0.33)
  Top 0.254: v58.29,13.87 58.6,14.18 U$26.6
  Top 1.016: U$24.2 58.67,16.87 U$26.6
  Bottom 0.254: U$29.21 39.5,18.16 39.98,17.68 39.98,9.04 40.46,8.56 55.91,8.56 56.59,9.25 56.59,12.17 v58.29,13.87
  pour Top (no thermals): 51.46,28.98 60.41,28.98 60.41,27.15 51.46,27.15
SCL
  Bottom 0.254: U$29.27 24.28,20.6 25.53,21.84 25.53,32.51 26.42,33.4 26.42,36 26.43,36.02 26.43,45.49 33.96,53.01 U$31.4
SDA
  Bottom 0.254: U$29.9 24.26,41.95 24.28,41.96 24.28,44.65 34.54,54.91 48.54,54.91 U$31.6 62.86,54.93
TX
  Bottom 0.305: U$27.7 11.84,13.36 11.84,21.28 U$29.12

### Text on the board
tPlace: Thruster Main Board V1.1 | Designed by Shih Chiang | E:/dick.bmp